# Altium schematic sheet FPGA_IO_0_1_2.SchDoc
size 558 x 431 mm; SheetNumber: 8; SheetTotal: 12; Sheet_Name: FPGA IO BANKS 0, 1 & 2; Size: 11x17
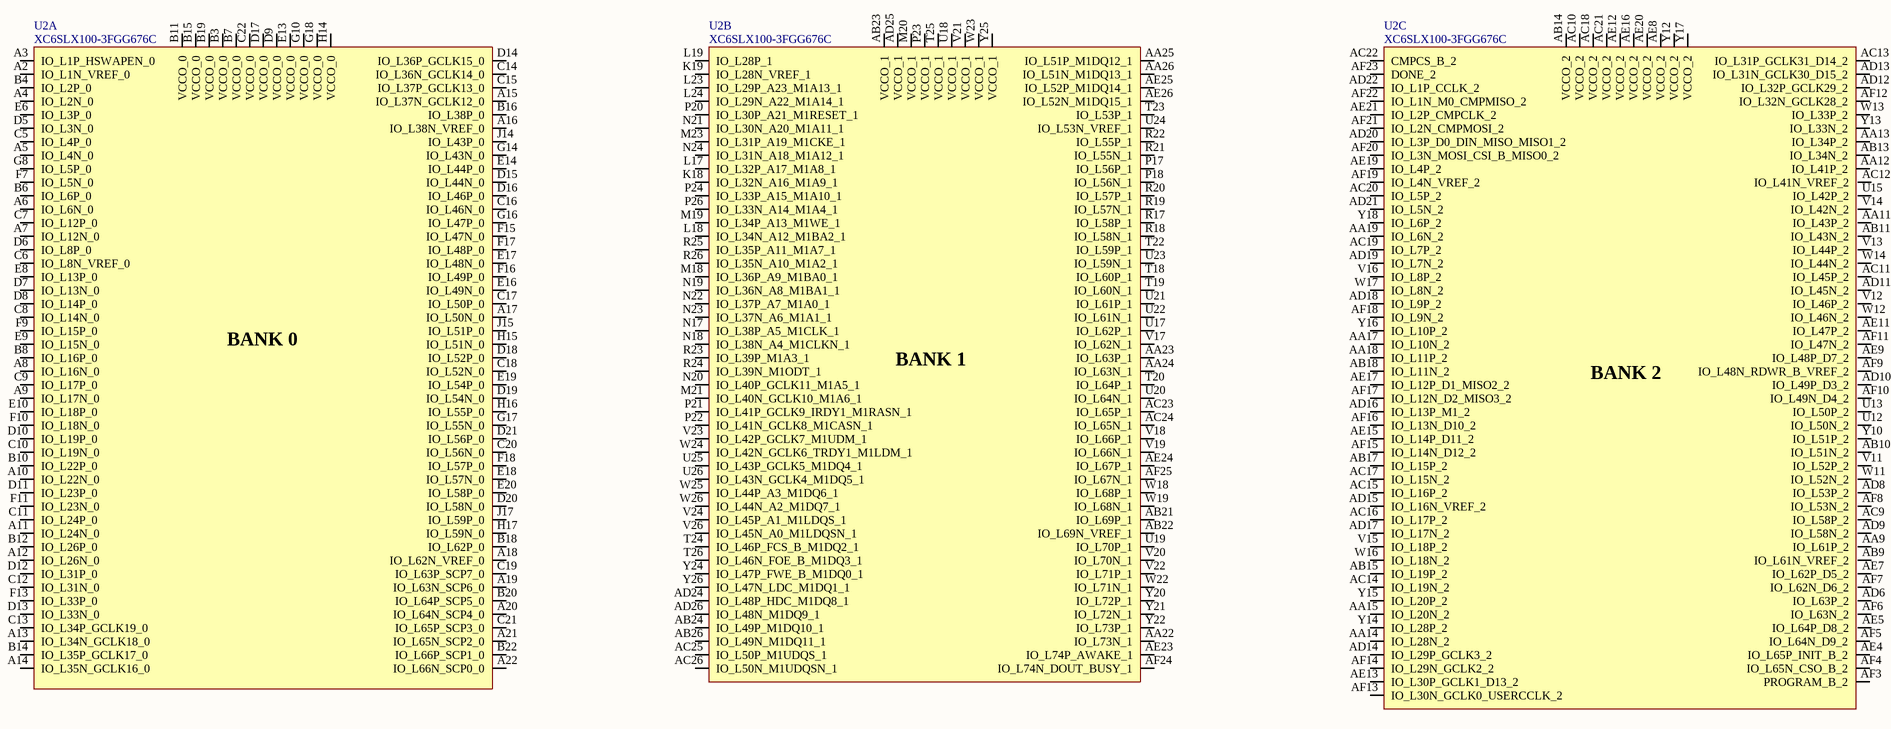
[diagram p0: FPGA_IO_0_1_2.SchDoc]

## Parts
U2  XC6SLX100-3FGG676C  [FPGA_XILINX_FGG676]  (parts A,B,C of 10)

## Nets

Not connected (* = marked no-connect by the designer): U2 A2(IO_L1N_VREF_0) A3(IO_L1P_HSWAPEN_0) A4(IO_L2N_0) A5(IO_L4N_0) A6(IO_L6N_0) A7(IO_L12N_0) A8(IO_L16N_0) A9(IO_L17N_0) A10(IO_L22N_0) A11(IO_L24N_0) A12(IO_L26N_0) A13(IO_L34N_GCLK18_0) A14(IO_L35N_GCLK16_0) A15(IO_L37N_GCLK12_0) A16(IO_L38N_VREF_0) A17(IO_L50N_0) A18(IO_L62N_VREF_0) A19(IO_L63N_SCP6_0) A20(IO_L64N_SCP4_0) A21(IO_L65N_SCP2_0) A22(IO_L66N_SCP0_0) AA9(IO_L61P_2) AA11(IO_L43P_2) AA12(IO_L41P_2) AA13(IO_L34P_2) AA14(IO_L28N_2) AA15(IO_L20N_2) AA17(IO_L10N_2) AA18(IO_L11P_2) AA19(IO_L6N_2) AA22(IO_L73N_1) AA23(IO_L63P_1) AA24(IO_L63N_1) AA25(IO_L51P_M1DQ12_1) AA26(IO_L51N_M1DQ13_1) AB9(IO_L61N_VREF_2) AB10(IO_L51N_2) AB11(IO_L43N_2) AB13(IO_L34N_2) AB14(VCCO_2) AB15(IO_L19P_2) AB17(IO_L15P_2) AB18(IO_L11N_2) AB21(IO_L69P_1) AB22(IO_L69N_VREF_1) AB23(VCCO_1) AB24(IO_L49P_M1DQ10_1) AB26(IO_L49N_M1DQ11_1) AC9(IO_L58P_2) AC10(VCCO_2) AC11(IO_L45P_2) AC12(IO_L41N_VREF_2) AC13(IO_L31P_GCLK31_D14_2) AC14(IO_L19N_2) AC15(IO_L16P_2) AC16(IO_L17P_2) AC17(IO_L15N_2) AC18(VCCO_2) AC19(IO_L7P_2) AC20(IO_L5P_2) AC21(VCCO_2) AC22(CMPCS_B_2) AC23(IO_L65P_1) AC24(IO_L65N_1) AC25(IO_L50P_M1UDQS_1) AC26(IO_L50N_M1UDQSN_1) AD6(IO_L63P_2) AD8(IO_L53P_2) AD9(IO_L58N_2) AD10(IO_L49P_D3_2) AD11(IO_L45N_2) AD12(IO_L32P_GCLK29_2) AD13(IO_L31N_GCLK30_D15_2) AD14(IO_L29P_GCLK3_2) AD15(IO_L16N_VREF_2) AD16(IO_L13P_M1_2) AD17(IO_L17N_2) AD18(IO_L9P_2) AD19(IO_L7N_2) AD20(IO_L3P_D0_DIN_MISO_MISO1_2) AD21(IO_L5N_2) AD22(IO_L1P_CCLK_2) AD24(IO_L48P_HDC_M1DQ8_1) AD25(VCCO_1) AD26(IO_L48N_M1DQ9_1) AE4(IO_L65P_INIT_B_2) AE5(IO_L64P_D8_2) AE7(IO_L62P_D5_2) AE8(VCCO_2) AE9(IO_L48P_D7_2) AE11(IO_L47P_2) AE12(VCCO_2) AE13(IO_L30P_GCLK1_D13_2) AE15(IO_L14P_D11_2) AE16(VCCO_2) AE17(IO_L12P_D1_MISO2_2) AE19(IO_L4P_2) AE20(VCCO_2) AE21(IO_L2P_CMPCLK_2) AE23(IO_L74P_AWAKE_1) AE24(IO_L67P_1) AE25(IO_L52P_M1DQ14_1) AE26(IO_L52N_M1DQ15_1) AF3(PROGRAM_B_2) AF4(IO_L65N_CSO_B_2) AF5(IO_L64N_D9_2) AF6(IO_L63N_2) AF7(IO_L62N_D6_2) AF8(IO_L53N_2) AF9(IO_L48N_RDWR_B_VREF_2) AF10(IO_L49N_D4_2) AF11(IO_L47N_2) AF12(IO_L32N_GCLK28_2) AF13(IO_L30N_GCLK0_USERCCLK_2) AF14(IO_L29N_GCLK2_2) AF15(IO_L14N_D12_2) AF16(IO_L13N_D10_2) AF17(IO_L12N_D2_MISO3_2) AF18(IO_L9N_2) AF19(IO_L4N_VREF_2) AF20(IO_L3N_MOSI_CSI_B_MISO0_2) AF21(IO_L2N_CMPMOSI_2) AF22(IO_L1N_M0_CMPMISO_2) AF23(DONE_2) AF24(IO_L74N_DOUT_BUSY_1) AF25(IO_L67N_1) B3(VCCO_0) B4(IO_L2P_0) B6(IO_L6P_0) B7(VCCO_0) B8(IO_L16P_0) B10(IO_L22P_0) B11(VCCO_0) B12(IO_L26P_0) B14(IO_L35P_GCLK17_0) B15(VCCO_0) B16(IO_L38P_0) B18(IO_L62P_0) B19(VCCO_0) B20(IO_L64P_SCP5_0) B22(IO_L66P_SCP1_0) C5(IO_L4P_0) C6(IO_L8N_VREF_0) C7(IO_L12P_0) C8(IO_L14N_0) C9(IO_L17P_0) C10(IO_L19N_0) C11(IO_L24P_0) C12(IO_L31N_0) C13(IO_L34P_GCLK19_0) C14(IO_L36N_GCLK14_0) C15(IO_L37P_GCLK13_0) C16(IO_L46N_0) C17(IO_L50P_0) C18(IO_L52N_0) C19(IO_L63P_SCP7_0) C20(IO_L56N_0) C21(IO_L65P_SCP3_0) C22(VCCO_0) D5(IO_L3N_0) D6(IO_L8P_0) D7(IO_L13N_0) D8(IO_L14P_0) D9(VCCO_0) D10(IO_L19P_0) D11(IO_L23P_0) D12(IO_L31P_0) D13(IO_L33N_0) D14(IO_L36P_GCLK15_0) D15(IO_L44N_0) D16(IO_L46P_0) D17(VCCO_0) D18(IO_L52P_0) D19(IO_L54N_0) D20(IO_L58N_0) D21(IO_L56P_0) E6(IO_L3P_0) E8(IO_L13P_0) E9(IO_L15N_0) E10(IO_L18P_0) E13(VCCO_0) E14(IO_L44P_0) E16(IO_L49N_0) E17(IO_L48N_0) E18(IO_L57N_0) E19(IO_L54P_0) E20(IO_L58P_0) F7(IO_L5N_0) F9(IO_L15P_0) F10(IO_L18N_0) F11(IO_L23N_0) F13(IO_L33P_0) F15(IO_L47N_0) F16(IO_L49P_0) F17(IO_L48P_0) F18(IO_L57P_0) G8(IO_L5P_0) G10(VCCO_0) G14(IO_L43N_0) G16(IO_L47P_0) G17(IO_L55N_0) G18(VCCO_0) H14(VCCO_0) H15(IO_L51N_0) H16(IO_L55P_0) H17(IO_L59N_0) J14(IO_L43P_0) J15(IO_L51P_0) J17(IO_L59P_0) K18(IO_L32N_A16_M1A9_1) K19(IO_L28N_VREF_1) L17(IO_L32P_A17_M1A8_1) L18(IO_L34N_A12_M1BA2_1) L19(IO_L28P_1) L23(IO_L29P_A23_M1A13_1) L24(IO_L29N_A22_M1A14_1) M18(IO_L36P_A9_M1BA0_1) M19(IO_L34P_A13_M1WE_1) M20(VCCO_1) M21(IO_L40N_GCLK10_M1A6_1) M23(IO_L31P_A19_M1CKE_1) N17(IO_L38P_A5_M1CLK_1) N18(IO_L38N_A4_M1CLKN_1) N19(IO_L36N_A8_M1BA1_1) N20(IO_L40P_GCLK11_M1A5_1) N21(IO_L30N_A20_M1A11_1) N22(IO_L37P_A7_M1A0_1) N23(IO_L37N_A6_M1A1_1) N24(IO_L31N_A18_M1A12_1) P17(IO_L56P_1) P18(IO_L56N_1) P20(IO_L30P_A21_M1RESET_1) P21(IO_L41P_GCLK9_IRDY1_M1RASN_1) P22(IO_L41N_GCLK8_M1CASN_1) P23(VCCO_1) P24(IO_L33P_A15_M1A10_1) P26(IO_L33N_A14_M1A4_1) R17(IO_L58P_1) R18(IO_L58N_1) R19(IO_L57N_1) R20(IO_L57P_1) R21(IO_L55N_1) R22(IO_L55P_1) R23(IO_L39P_M1A3_1) R24(IO_L39N_M1ODT_1) R25(IO_L35P_A11_M1A7_1) R26(IO_L35N_A10_M1A2_1) T18(IO_L60P_1) T19(IO_L60N_1) T20(IO_L64P_1) T22(IO_L59P_1) T23(IO_L53P_1) T24(IO_L46P_FCS_B_M1DQ2_1) T25(VCCO_1) T26(IO_L46N_FOE_B_M1DQ3_1) U12(IO_L50N_2) U13(IO_L50P_2) U15(IO_L42P_2) U17(IO_L62P_1) U18(VCCO_1) U19(IO_L70P_1) U20(IO_L64N_1) U21(IO_L61P_1) U22(IO_L61N_1) U23(IO_L59N_1) U24(IO_L53N_VREF_1) U25(IO_L43P_GCLK5_M1DQ4_1) U26(IO_L43N_GCLK4_M1DQ5_1) V11(IO_L52P_2) V12(IO_L46P_2) V13(IO_L44P_2) V14(IO_L42N_2) V15(IO_L18P_2) V16(IO_L8P_2) V17(IO_L62N_1) V18(IO_L66P_1) V19(IO_L66N_1) V20(IO_L70N_1) V21(VCCO_1) V22(IO_L71P_1) V23(IO_L42P_GCLK7_M1UDM_1) V24(IO_L45P_A1_M1LDQS_1) V26(IO_L45N_A0_M1LDQSN_1) W11(IO_L52N_2) W12(IO_L46N_2) W13(IO_L33P_2) W14(IO_L44N_2) W16(IO_L18N_2) W17(IO_L8N_2) W18(IO_L68P_1) W19(IO_L68N_1) W22(IO_L71N_1) W23(VCCO_1) W24(IO_L42N_GCLK6_TRDY1_M1LDM_1) W25(IO_L44P_A3_M1DQ6_1) W26(IO_L44N_A2_M1DQ7_1) Y10(IO_L51P_2) Y12(VCCO_2) Y13(IO_L33N_2) Y14(IO_L28P_2) Y15(IO_L20P_2) Y16(IO_L10P_2) Y17(VCCO_2) Y18(IO_L6P_2) Y20(IO_L72P_1) Y21(IO_L72N_1) Y22(IO_L73P_1) Y24(IO_L47P_FWE_B_M1DQ0_1) Y25(VCCO_1) Y26(IO_L47N_LDC_M1DQ1_1)

## Notes on the sheet
- Sheet Name
- Project Title
- Global Project
- Revision
- Size
- Date
- Group
- Sheet
- of
- Filename
- Designers
- (in symbol FPGA_XC6SLX100-3FGG676C, part A) BANK 0
- (in symbol FPGA_XC6SLX100-3FGG676C, part B) BANK 1
- (in symbol FPGA_XC6SLX100-3FGG676C, part C) BANK 2

## Library data of the parts
U2 = FPGA_XC6SLX100-3FGG676C: FPGA - XILINX SPARTAN 6 480 I/O - BGA-676; Voltage: 1.14 V ~ 1.26 V; Current: *; Power: *; Mfg: Xilinx; Mfg Part Number: XC6SLX100-3FGG676C; HelpURL: https://www.xilinx.com/support/documentation/data_sheets/ds162.pdf; CreatedBy: Jonathan Bouchard; Temperature: 0°C ~ 85°C (TJ); Value: *; Precision: *; Package: BGA-676; Supplier 1: Digikey; Supplier Part Number 1: 122-1760-ND